# EAGLE schematic V6.0 Circuit (EAGLE 7.6.0)
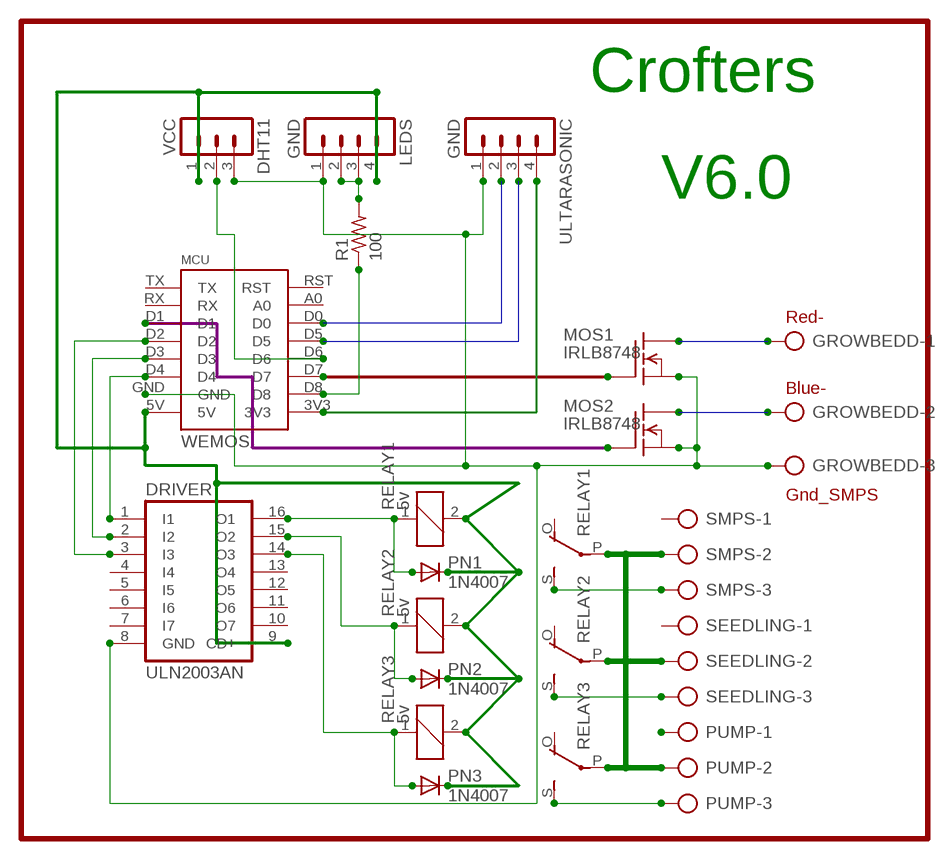
[diagram p0: schematic, sheet 1]

## Parts
DHT11  VCC  MA03-1  [MA03-1]
DRIVER  ULN2003AN  [DIL16]
GROWBEDD  AK300/3  [AK300/3]
LEDS  GND  MA04-1  [MA04-1]
MCU  WEMOS  [WEMOS]
MOS1  IRLB8748  IRF540  [TO220]
MOS2  IRLB8748  IRF540  [TO220]
PN1  1N4007  1N4004  [DO41-10]
PN2  1N4007  1N4004  [DO41-10]
PN3  1N4007  1N4004  [DO41-10]
PUMP  AK300/3  [AK300/3]
R1  100  R-US_0207/7  [0207/7]
RELAY1  5v  ZF112  [ZF112]
RELAY2  5v  ZF112  [ZF112]
RELAY3  5v  ZF112  [ZF112]
SEEDLING  AK300/3  [AK300/3]
SMPS  AK300/3  [AK300/3]
ULTARASONIC  GND  MA04-1  [MA04-1]

## Nets
N$1: DRIVER.3(I3) MCU.D2
N$2: DRIVER.2(I2) MCU.D3
N$3: DRIVER.1(I1) MCU.D4
N$4: DRIVER.16(O1) PN1.A RELAY1.1
N$5: DRIVER.15(O2) PN2.A RELAY2.1
N$6: DRIVER.14(O3) PN3.A RELAY3.1
N$7: DHT11.3 DRIVER.8(GND) GROWBEDD.3 LEDS.1 MCU.GND MOS1.3(S) MOS2.3(S) ULTARASONIC.1
N$8: RELAY1.S(2:S) SMPS.3
N$9: RELAY2.S(2:S) SEEDLING.3
N$10: PUMP.3 RELAY3.S(2:S)
N$11: PUMP.2 RELAY1.P(2:P) RELAY2.P(2:P) RELAY3.P(2:P) SEEDLING.2 SMPS.2
N$12: DHT11.1 DRIVER.9(CD+) LEDS.4 MCU.5V PN1.C PN2.C PN3.C RELAY1.2 RELAY2.2 RELAY3.2
N$13: MCU.3V3 ULTARASONIC.4
N$14: ULTARASONIC.2
N$15: LEDS.2 LEDS.3 R1.2
N$16: MCU.D8 R1.1
N$17: DHT11.2 MCU.D6
N$18: ULTARASONIC.3
N$19: MCU.D1
N$20: MCU.D0
N$21: MCU.D5
N$22: MCU.D7
N$23: MOS1.1(G)
N$24: MOS1.2(D)
N$25: MOS2.2(D)
N$26: MOS2.1(G)
N$27: GROWBEDD.2
N$28: GROWBEDD.1
N$29: PUMP.1
Unconnected: DRIVER.4(I4) DRIVER.5(I5) DRIVER.6(I6) DRIVER.7(I7) DRIVER.10(O7) DRIVER.11(O6) DRIVER.12(O5) DRIVER.13(O4) MCU.A0 MCU.RST MCU.RX MCU.TX RELAY1.O(2:O) RELAY2.O(2:O) RELAY3.O(2:O) SEEDLING.1 SMPS.1

## Buses
B$1
B$2
B$3
B$4

## Notes on the sheet
- Crofters
- V6.0
- Red-
- Blue-
- Gnd_SMPS

## Library data of the parts
DHT11 = con-lstb:MA03-1: PIN HEADER; OC_FARNELL: unknown; OC_NEWARK: unknown
DRIVER = uln-udn:ULN2003A: DRIVER ARRAY
GROWBEDD PUMP SEEDLING SMPS = con-ptr500:AK300/3: CONNECTOR; OC_FARNELL: unknown; OC_NEWARK: unknown
LEDS ULTARASONIC = con-lstb:MA04-1: PIN HEADER; OC_FARNELL: unknown; OC_NEWARK: unknown
MCU = Wemos:WEMOS
MOS1 MOS2 = transistor-fet:IRF540: N-Channel Enhancement MOSFET (HEXFET); 100V; 28A; 0,077Ohm
PN1-PN3 = diode:1N4004: DIODE general purpose rectifier, 1 A
R1 = rcl:R-US_: RESISTOR, American symbol
RELAY1-RELAY3 = relay:ZF112: RELAY 1 x switch; OC_FARNELL: unknown; OC_NEWARK: unknown